# EAGLE schematic qPCR_pcb_module_power (EAGLE 9.6.1)
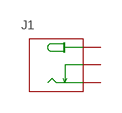
[diagram p0: schematic, sheet 1]

## Parts
J1  JACK-DC-005'DC-005'  [3P-L14.2*W11.0*H9.0MM]
Unconnected: J1.+B(+) J1.+T(+) J1.-1B(-) J1.-1T(-) J1.-2B(CDN) J1.-2T(CDN)

## Library data of the parts
J1 = OPL_Connector:JACK-DC-005: Seeed SKU 320120003 - DIP Black DC Jack 2.1MM MPN: DC-005 Important Notes: This part requires milling slots. Please make sure layer 46 Milling is included in the profile or outline layer when exporting Gerber files. Alternatively, you can use the built-in Seeed Fusion CAM file. Find it under Third-Party CAM files. Seeed Fusion PCBA OPL <https://www.seeedstudio.com/opl.html> Order PCB/PCBA Now <https://www.seeedstudio.com/fusion_pcb.html> www.seeedstudio.com